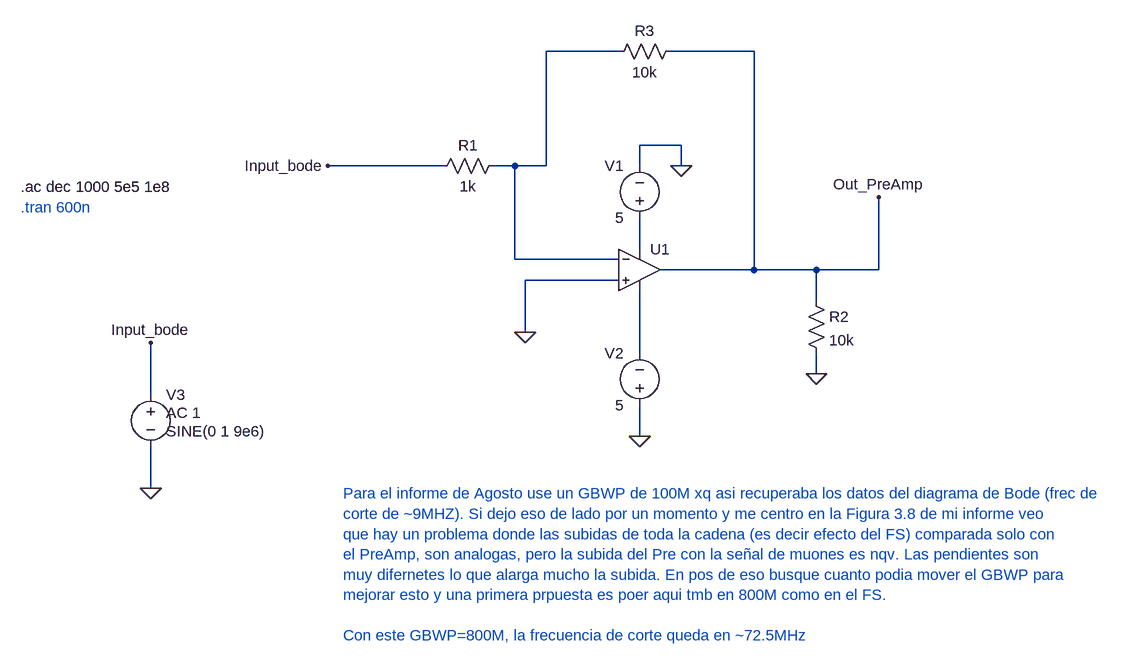
[diagram p0: schematic preamp_sin_capacitores_gbwp_test.asc]
preamp_sin_capacitores_gbwp_test.asc, the LTspice schematic file:
Version 4
SHEET 1 956 748
WIRE 128 -144 16 -144
WIRE 336 -144 208 -144
WIRE 224 0 160 0
WIRE -144 32 -320 32
WIRE -32 32 -64 32
WIRE 16 32 16 -144
WIRE 16 32 -32 32
WIRE 160 32 160 0
WIRE 224 32 224 0
WIRE 160 160 160 112
WIRE -32 176 -32 32
WIRE 128 176 -32 176
WIRE 336 192 336 -144
WIRE 336 192 192 192
WIRE 432 192 336 192
WIRE 528 192 528 80
WIRE 528 192 432 192
WIRE 128 208 -16 208
WIRE 432 240 432 192
WIRE -16 288 -16 208
WIRE 160 320 160 224
WIRE 432 352 432 320
WIRE -592 384 -592 304
WIRE 160 448 160 400
WIRE -592 528 -592 464
FLAG 160 448 0
FLAG 224 32 0
FLAG -16 288 0
FLAG 528 80 Out_PreAmp
FLAG -320 32 Input_bode
FLAG 432 352 0
FLAG -592 528 0
FLAG -592 304 Input_bode
SYMBOL res -48 16 R90
WINDOW 0 0 56 VBottom 2
WINDOW 3 32 56 VTop 2
SYMATTR InstName R1
SYMATTR Value 1k
SYMBOL voltage 160 128 R180
WINDOW 0 24 96 Left 2
WINDOW 3 24 16 Left 2
WINDOW 123 0 0 Left 0
WINDOW 39 0 0 Left 0
SYMATTR InstName V1
SYMATTR Value 5
SYMBOL voltage 160 416 R180
WINDOW 0 24 96 Left 2
WINDOW 3 24 16 Left 2
WINDOW 123 0 0 Left 0
WINDOW 39 0 0 Left 0
SYMATTR InstName V2
SYMATTR Value 5
SYMBOL OpAmps\\UniversalOpAmp1 160 192 R0
SYMATTR InstName U1
SYMATTR Value2 Avol=1Meg GBW=800Meg Vos=0
SYMBOL res 416 224 R0
SYMATTR InstName R2
SYMATTR Value 10k
SYMBOL res 224 -160 R90
WINDOW 0 0 56 VBottom 2
WINDOW 3 32 56 VTop 2
SYMATTR InstName R3
SYMATTR Value 10k
SYMBOL voltage -592 368 R0
WINDOW 123 24 44 Left 2
WINDOW 39 0 0 Left 0
WINDOW 3 24 72 Left 2
SYMATTR Value2 AC 1
SYMATTR Value SINE(0 1 9e6)
SYMATTR InstName V3
TEXT -792 96 Left 2 ;.tran 600n
TEXT -792 64 Left 2 !.ac dec 1000 5e5 1e8
TEXT -296 536 Left 2 ;Para el informe de Agosto use un GBWP de 100M xq asi recuperaba los datos del diagrama de Bode (frec de\ncorte de ~9MHZ). Si dejo eso de lado por un momento y me centro en la Figura 3.8 de mi informe veo \nque hay un problema donde las subidas de toda la cadena (es decir efecto del FS) comparada solo con \nel PreAmp, son analogas, pero la subida del Pre con la señal de muones es nqv. Las pendientes son \nmuy difernetes lo que alarga mucho la subida. En pos de eso busque cuanto podia mover el GBWP para \nmejorar esto y una primera prpuesta es poer aqui tmb en 800M como en el FS.\n \nCon este GBWP=800M, la frecuencia de corte queda en ~72.5MHz

The netlist it stands for:
* preamp_sin_capacitores_gbwp_test.asc
R1 N001 Input_bode 1k
V1 N002 0 5
V2 0 N003 5
XU1 0 N001 N002 N003 Out_PreAmp level1 Avol=1Meg GBW=800Meg Vos=0 En=0 Enk=0 In=0 Ink=0 Rin=500Meg  ; pins In+ In- V+ V- OUT
R2 Out_PreAmp 0 10k
R3 Out_PreAmp N001 10k
V3 Input_bode 0 SINE(0 1 9e6) AC 1
* .tran 600n
.ac dec 1000 5e5 1e8
* Para el informe de Agosto use un GBWP de 100M xq asi recuperaba los datos del diagrama de Bode (frec de
* corte de ~9MHZ). Si dejo eso de lado por un momento y me centro en la Figura 3.8 de mi informe veo
* que hay un problema donde las subidas de toda la cadena (es decir efecto del FS) comparada solo con
* el PreAmp, son analogas, pero la subida del Pre con la señal de muones es nqv. Las pendientes son
* muy difernetes lo que alarga mucho la subida. En pos de eso busque cuanto podia mover el GBWP para
* mejorar esto y una primera prpuesta es poer aqui tmb en 800M como en el FS.
* Con este GBWP=800M, la frecuencia de corte queda en ~72.5MHz
.lib UniversalOpAmp1.lib
.backanno
.end